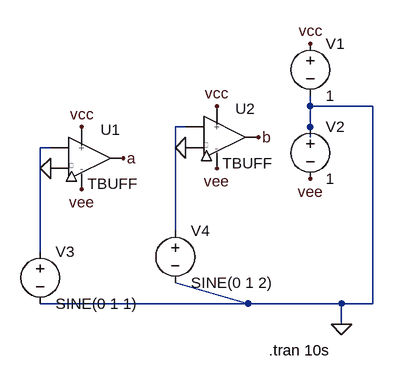
[diagram p0: schematic Draft1.asc]
Draft1.asc, the LTspice schematic file:
Version 4
SHEET 1 880 680
WIRE 432 192 432 176
WIRE 528 192 432 192
WIRE 240 224 224 224
WIRE 432 224 432 192
WIRE 432 240 432 224
WIRE 32 256 16 256
WIRE 224 384 224 224
WIRE 16 416 16 256
WIRE 336 496 224 464
WIRE 336 496 16 496
WIRE 480 496 336 496
WIRE 528 496 528 192
WIRE 528 496 480 496
WIRE 480 528 480 496
FLAG 480 528 0
FLAG 432 96 vcc
FLAG 432 304 vee
FLAG 144 272 a
FLAG 352 240 b
FLAG 240 256 0
FLAG 32 288 0
FLAG 80 224 vcc
FLAG 288 192 vcc
FLAG 288 288 vee
FLAG 80 320 vee
SYMBOL voltage 432 80 R0
SYMATTR InstName V1
SYMATTR Value 1
SYMBOL voltage 432 208 R0
SYMATTR InstName V2
SYMATTR Value 1
SYMBOL voltage 16 400 R0
SYMATTR InstName V3
SYMATTR Value SINE(0 1 1)
SYMBOL voltage 224 368 R0
SYMATTR InstName V4
SYMATTR Value SINE(0 1 2)
SYMBOL TBUFF 96 272 R0
SYMATTR InstName U1
SYMBOL TBUFF 304 240 R0
SYMATTR InstName U2
TEXT 368 568 Left 2 !.tran 10s

The netlist it stands for:
* Draft1.asc
V1 vcc 0 1
V2 0 vee 1
V3 N002 0 SINE(0 1 1)
V4 N001 0 SINE(0 1 2)
XU1 N002 vcc vee a 0 TBUFF  ; pins in vcc vee out gnd
XU2 N001 vcc vee b 0 TBUFF  ; pins in vcc vee out gnd
.tran 10s
.lib /Users/manoelribeiroalmeida/dev/trit/LTspice/TBUFF.sub
.backanno
.end